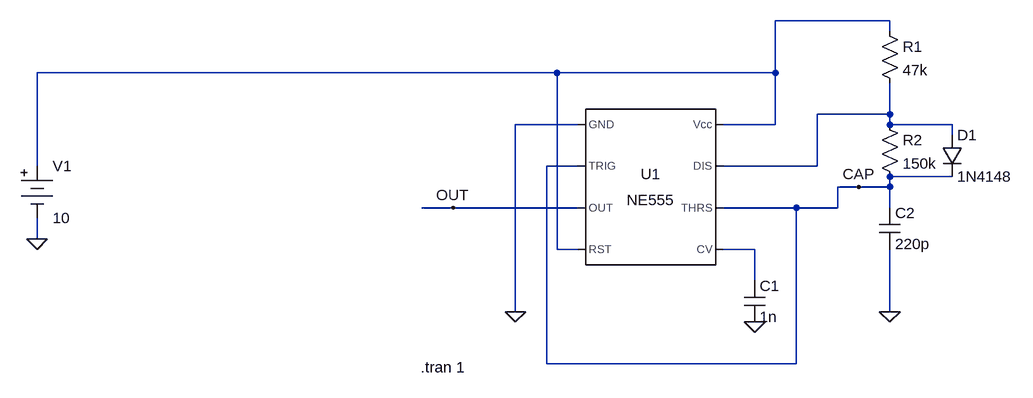
[diagram p0: schematic Draft1.asc]
Draft1.asc, the LTspice schematic file:
Version 4
SHEET 1 1224 680
WIRE 608 -80 432 -80
WIRE 608 -64 608 -80
WIRE 96 0 -704 0
WIRE 432 0 432 -80
WIRE 432 0 96 0
WIRE 608 64 608 16
WIRE 608 64 496 64
WIRE 128 80 32 80
WIRE 432 80 432 0
WIRE 432 80 352 80
WIRE 608 80 608 64
WIRE 704 80 608 80
WIRE 704 96 704 80
WIRE -704 144 -704 0
WIRE 128 144 80 144
WIRE 496 144 496 64
WIRE 496 144 352 144
WIRE 704 160 608 160
WIRE 560 176 528 176
WIRE 608 176 608 160
WIRE 608 176 560 176
WIRE -64 208 -112 208
WIRE 128 208 -64 208
WIRE 464 208 352 208
WIRE 528 208 528 176
WIRE 528 208 464 208
WIRE 608 208 608 176
WIRE -704 256 -704 224
WIRE 96 272 96 0
WIRE 128 272 96 272
WIRE 400 272 352 272
WIRE 400 320 400 272
WIRE 32 368 32 80
WIRE 608 368 608 272
WIRE 80 448 80 144
WIRE 464 448 464 208
WIRE 464 448 80 448
FLAG 32 368 0
FLAG 400 384 0
FLAG 608 368 0
FLAG -64 208 OUT
FLAG 560 176 CAP
FLAG -704 256 0
SYMBOL Misc\\NE555 240 176 R0
SYMATTR InstName U1
SYMBOL cap 384 320 R0
SYMATTR InstName C1
SYMATTR Value 1n
SYMBOL res 592 -80 R0
SYMATTR InstName R1
SYMATTR Value 47k
SYMBOL res 592 64 R0
SYMATTR InstName R2
SYMATTR Value 150k
SYMBOL diode 688 96 R0
SYMATTR InstName D1
SYMATTR Value 1N4148
SYMBOL cap 592 208 R0
SYMATTR InstName C2
SYMATTR Value 220p
SYMBOL Misc\\battery -704 128 R0
WINDOW 123 0 0 Left 2
WINDOW 39 0 0 Left 2
SYMATTR InstName V1
SYMATTR Value 10
TEXT -114 454 Left 2 !.tran 1

The netlist it stands for:
* Draft1.asc
XU1 0 CAP OUT N001 N003 CAP N002 N001 NE555  ; pins GND TRIG OUT RST CV THRS DIS Vcc
C1 N003 0 1n
R1 N001 N002 47k
R2 N002 CAP 150k
D1 N002 CAP 1N4148
C2 CAP 0 220p
V1 N001 0 10
.model D D
.lib standard.dio
.tran 1
.lib NE555.sub
.backanno
.end